# Altium schematic sheet main.SchDoc
size A4; SheetNumber: 1; SheetTotal: 1; Size: A4
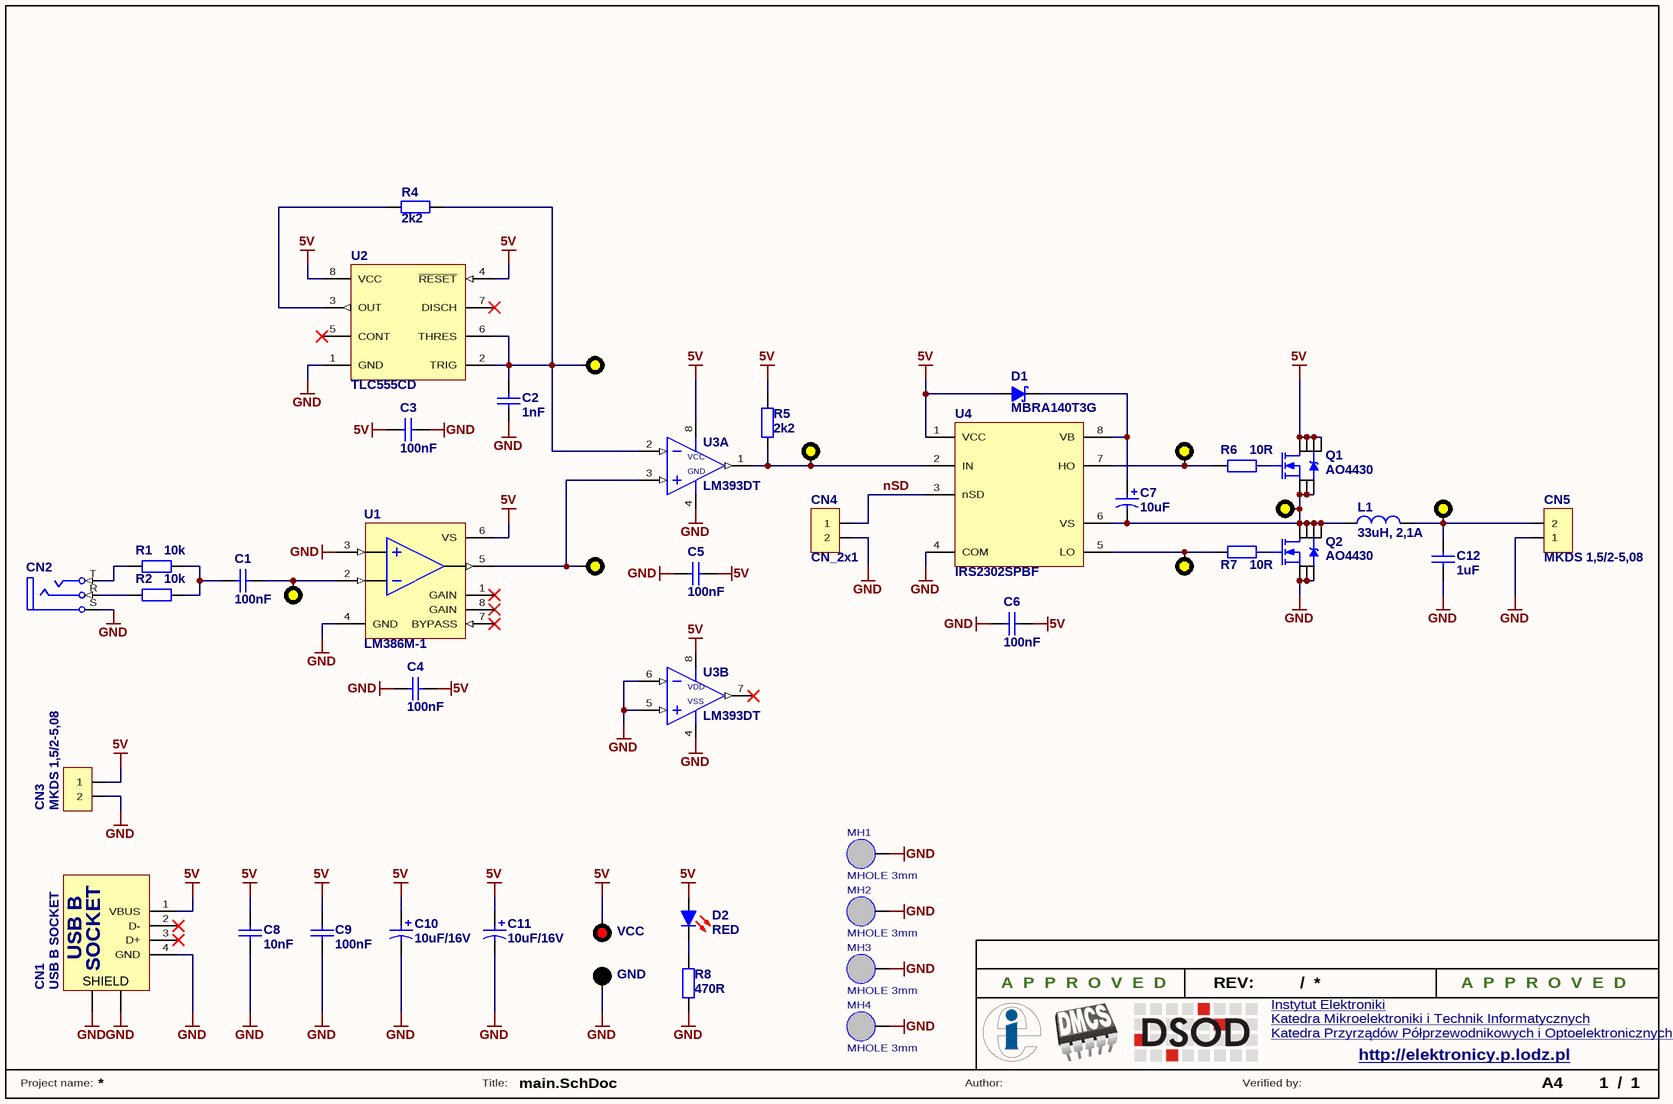
[diagram p0: main.SchDoc]

## Parts
C1  100nF  [C1206]
C2  1nF  [C1206]
C3  100nF  [C1206]
C4  100nF  [C1206]
C5  100nF  [C1206]
C6  100nF  [C1206]
C7  10uF  [CE5x7-2]
C8  10nF  [C1206]
C9  100nF  [C1206]
C10  10uF/16V  [CE5x7-2]
C11  10uF/16V  [CE5x7-2]
C12  1uF  [C1206]
CN1  USB B SOCKET  [USBB-G]
CN2  Lumberg 1503-08, Jack 3.5mm TRS  [LUMBERG_1503_07]  (value not drawn)
CN3  MKDS 1,5/2-5,08  [ARK2/3.5mm PITCH]
CN4  CN_2x1  [GP_2x1]
CN5  MKDS 1,5/2-5,08  [ARK2/3.5mm PITCH]
D1  MBRA140T3G  [SMA]
D2  RED  [LED1206R]
GND  Test Point BLACK  [CHINA_BLACK]  (value not drawn)
L1  33uH, 2,1A  [UNIVERSAL: DE12xx, DE07xx, DLxx,]
MH1  MHOLE 3mm  [3mm screw drill III]  (no BOM)
MH2  MHOLE 3mm  [3mm screw drill III]  (no BOM)
MH3  MHOLE 3mm  [3mm screw drill III]  (no BOM)
MH4  MHOLE 3mm  [3mm screw drill III]  (no BOM)
Q1  AO4430  [SO8]
Q2  AO4430  [SO8]
R1  10k  [R1206]
R2  10k  [R1206]
R4  2k2  [R1206]
R5  2k2  [R1206]
R6  10R  [R1206]
R7  10R  [R1206]
R8  470R  [R1206]
TP0  Test Point YELLOW  [CHINA_YELLOW]  (value not drawn)
TP1  Test Point YELLOW  [CHINA_YELLOW]  (value not drawn)
TP2  Test Point YELLOW  [CHINA_YELLOW]  (value not drawn)
TP3  Test Point YELLOW  [CHINA_YELLOW]  (value not drawn)
TP4  Test Point YELLOW  [CHINA_YELLOW]  (value not drawn)
TP5  Test Point YELLOW  [CHINA_YELLOW]  (value not drawn)
TP6  Test Point YELLOW  [CHINA_YELLOW]  (value not drawn)
TP7  Test Point YELLOW  [CHINA_YELLOW]  (value not drawn)
U1  LM386M-1  [SO8]
U2  TLC555CD  [SO8]
U3  LM393DT  [SO8]  (parts A,B of 2)
U4  IRS2302SPBF  [SO8]
VCC  Test Point RED  [CHINA_RED]  (value not drawn)

## Nets
5V: C3.1 C4.1 C5.1 C6.1 C8.2 C9.2 C10.1 C11.1 CN1.1(VBUS) CN3.1 D1.1(A) D2.1(A) Q1.5 Q1.6 Q1.7 Q1.8 R5.1 U1.6(VS) U2.4(~{RESET}) U2.8(VCC) U3.8(V+) U4.1(VCC) VCC.0
GND: C2.1 C3.2 C4.2 C5.2 C6.2 C8.1 C9.1 C10.2 C11.2 C12.1 CN1.4(GND) CN1.5(SHIELD) CN1.6(SHIELD) CN2.S CN3.2 CN4.2 CN5.1 GND.0 MH1.1(GND) MH2.1(GND) MH3.1(GND) MH4.1(GND) Q2.1 Q2.2 Q2.3 R8.1 U1.3(IN+) U1.4(GND) U2.1(GND) U3.4(GND) U3.5(IN+) U3.6(IN-) U4.4(COM)
nSD: CN4.1 U4.3(nSD)
NetC1_1: C1.1 R1.2 R2.2
NetC1_2: C1.2 TP0.0 U1.2(IN-)
NetC2_2: C2.2 R4.1 TP2.0 U2.2(TRIG) U2.6(THRES) U3.2(IN-)
NetC7_1: C7.1 D1.2(K) U4.8(VB)
NetC7_2: C7.2 L1.1 Q1.1 Q1.2 Q1.3 Q2.5 Q2.6 Q2.7 Q2.8 TP6.0 U4.6(VS)
NetC12_2: C12.2 CN5.2 L1.2 TP7.0
NetCN2_R: CN2.R R2.1
NetCN2_T: CN2.T R1.1
NetD2_2: D2.2(K) R8.2
NetQ1_4: Q1.4 R6.1
NetQ2_4: Q2.4 R7.1
NetR4_2: R4.2 U2.3(OUT)
NetR5_2: R5.2 TP3.0 U3.1(OUT) U4.2(IN)
NetR6_2: R6.2 TP5.0 U4.7(HO)
NetR7_2: R7.2 TP4.0 U4.5(LO)
NetTP1_0: TP1.0 U1.5(OUT) U3.3(IN+)

Not connected (* = marked no-connect by the designer): CN1 2(D-)* 3(D+)*; U1 1(GAIN)* 7(BYPASS)* 8(GAIN)*; U2 5(CONT)* 7(DISCH)*; U3 7(OUT)*

## Notes on the sheet
- A  P  P  R  O  V  E  D
- REV:
- /
- Instytut Elektroniki <http://www.eletel.p.lodz.pl/>
- Katedra Mikroelektroniki i Technik Informatycznych <https://www.dmcs.pl/>
- Katedra Przyrządów Półprzewodnikowych i Optoelektronicznych <http://www.dsod.p.lodz.pl/>
- http://elektronicy.p.lodz.pl
- Project name:
- Title:
- Author:
- Verified by:
- (in symbol LM393DT, part A) VCC
- (in symbol LM393DT, part B) VDD; VSS
- (in symbol USB B SOCKET) USB B; SOCKET

## Library data of the parts
C1-C6 C8 C9 C12 = Cap: Capacitor; ComponentLink1Description: datasheet; ComponentLink2Description: supplier
  C1 C3-C6 C9: Value: 100nF
  C2: Value: 1nF
  C8: Value: 10nF
  C12: Value: 1uF
C7 C10 C11 = Cap Pol: Polarized Capacitor; ComponentLink1Description: datasheet; ComponentLink2Description: supplier
  C7: Value: 10uF
  C10 C11: Value: 10uF/16V
CN1 = USB B SOCKET: USB connector; Published: 20-Mar-2006
CN2 = 1503-08: PackageDocument: 2003; PCB_Layout: Complies with manufacturer's recommendation.; DrillAndSlotSize: Corresponds to nominal value.; Published: 15-Jul-2004; LatestRevisionDate: 15-Jul-2004; LatestRevisionNote: Component Replaced.; DatasheetDocument: 2003; PackageReference: S1VS_SSS; Publisher: Altium Limited; ComponentLink1Description: Manufacturer Link; ComponentLink1URL: http://www.cliffuk.co.uk/
CN3 CN5 = MKDS 1,5/2-5,08: Phoenix Contact MKDS 1,5, PITCH 5,08mm Terminal Block
D1 = MBRA140T3G: Schottky barrier rectifier: 40V, 1A; Published: 22-Nov-2006; PackageReference: SMB
D2 = LED_RED: RED LED; Published: 04-Apr-2006
L1 = DE1205-33_UNIVERSAL: DE1205-33; Published: 08-Mar-2006; ComponentLink1Description: datasheet; ComponentLink2Description: supplier; Supplier 1: TME; Supplier Part Number 1: DE1205-33; Value: 33uH, 2,1A
MH1-MH4 = MHOLE_3MM: 3mm Mounting Hole
Q1 Q2 = AO4430: 30V N-Channel MOSFET; Published: 17-Dec-2003; DatasheetVersion: Mar-96; PackageVersion: 1996; PackageReference: SOT23; Publisher: Altium Limited; PackageDescription: SOT-23; 3 Leads; Body 3.1 x 2.5 mm, inc. leads (LxW max), Alternate Lead Configuration; ComponentLink1Description: Manufacturer Link; ComponentLink1URL: http://www.zetex.com/; ComponentLink2Description: Datasheet; ComponentLink2URL: www.zetex.com/3.0/pdf/BSS138.pdf
R1 R2 R4-R8 = Res: Resistor; Published: 19-Feb-2006; ComponentLink1Description: datasheet; ComponentLink2Description: supplier
  R1 R2: Value: 10k
  R4 R5: Value: 2k2
  R6 R7: Value: 10R
  R8: Value: 470R
U1 = LM386M-1: Dual Operational Amplifier; Published: 30-May-2007; PackageReference: SO-8
U2 = TLC555CD: Precision LinCMOS™ Timer; Supplier 1: TME; Supplier 2: Farnell; Supplier Part Number 1: TLC555CP; Supplier Part Number 2: 1103036
U3 = LM393DT: Low power dual voltage comparators; Published: 03-Apr-2006
U4 = IRS2302SPBF: Half bridge driver